# Altium project WSBD_Board.PrjPcb
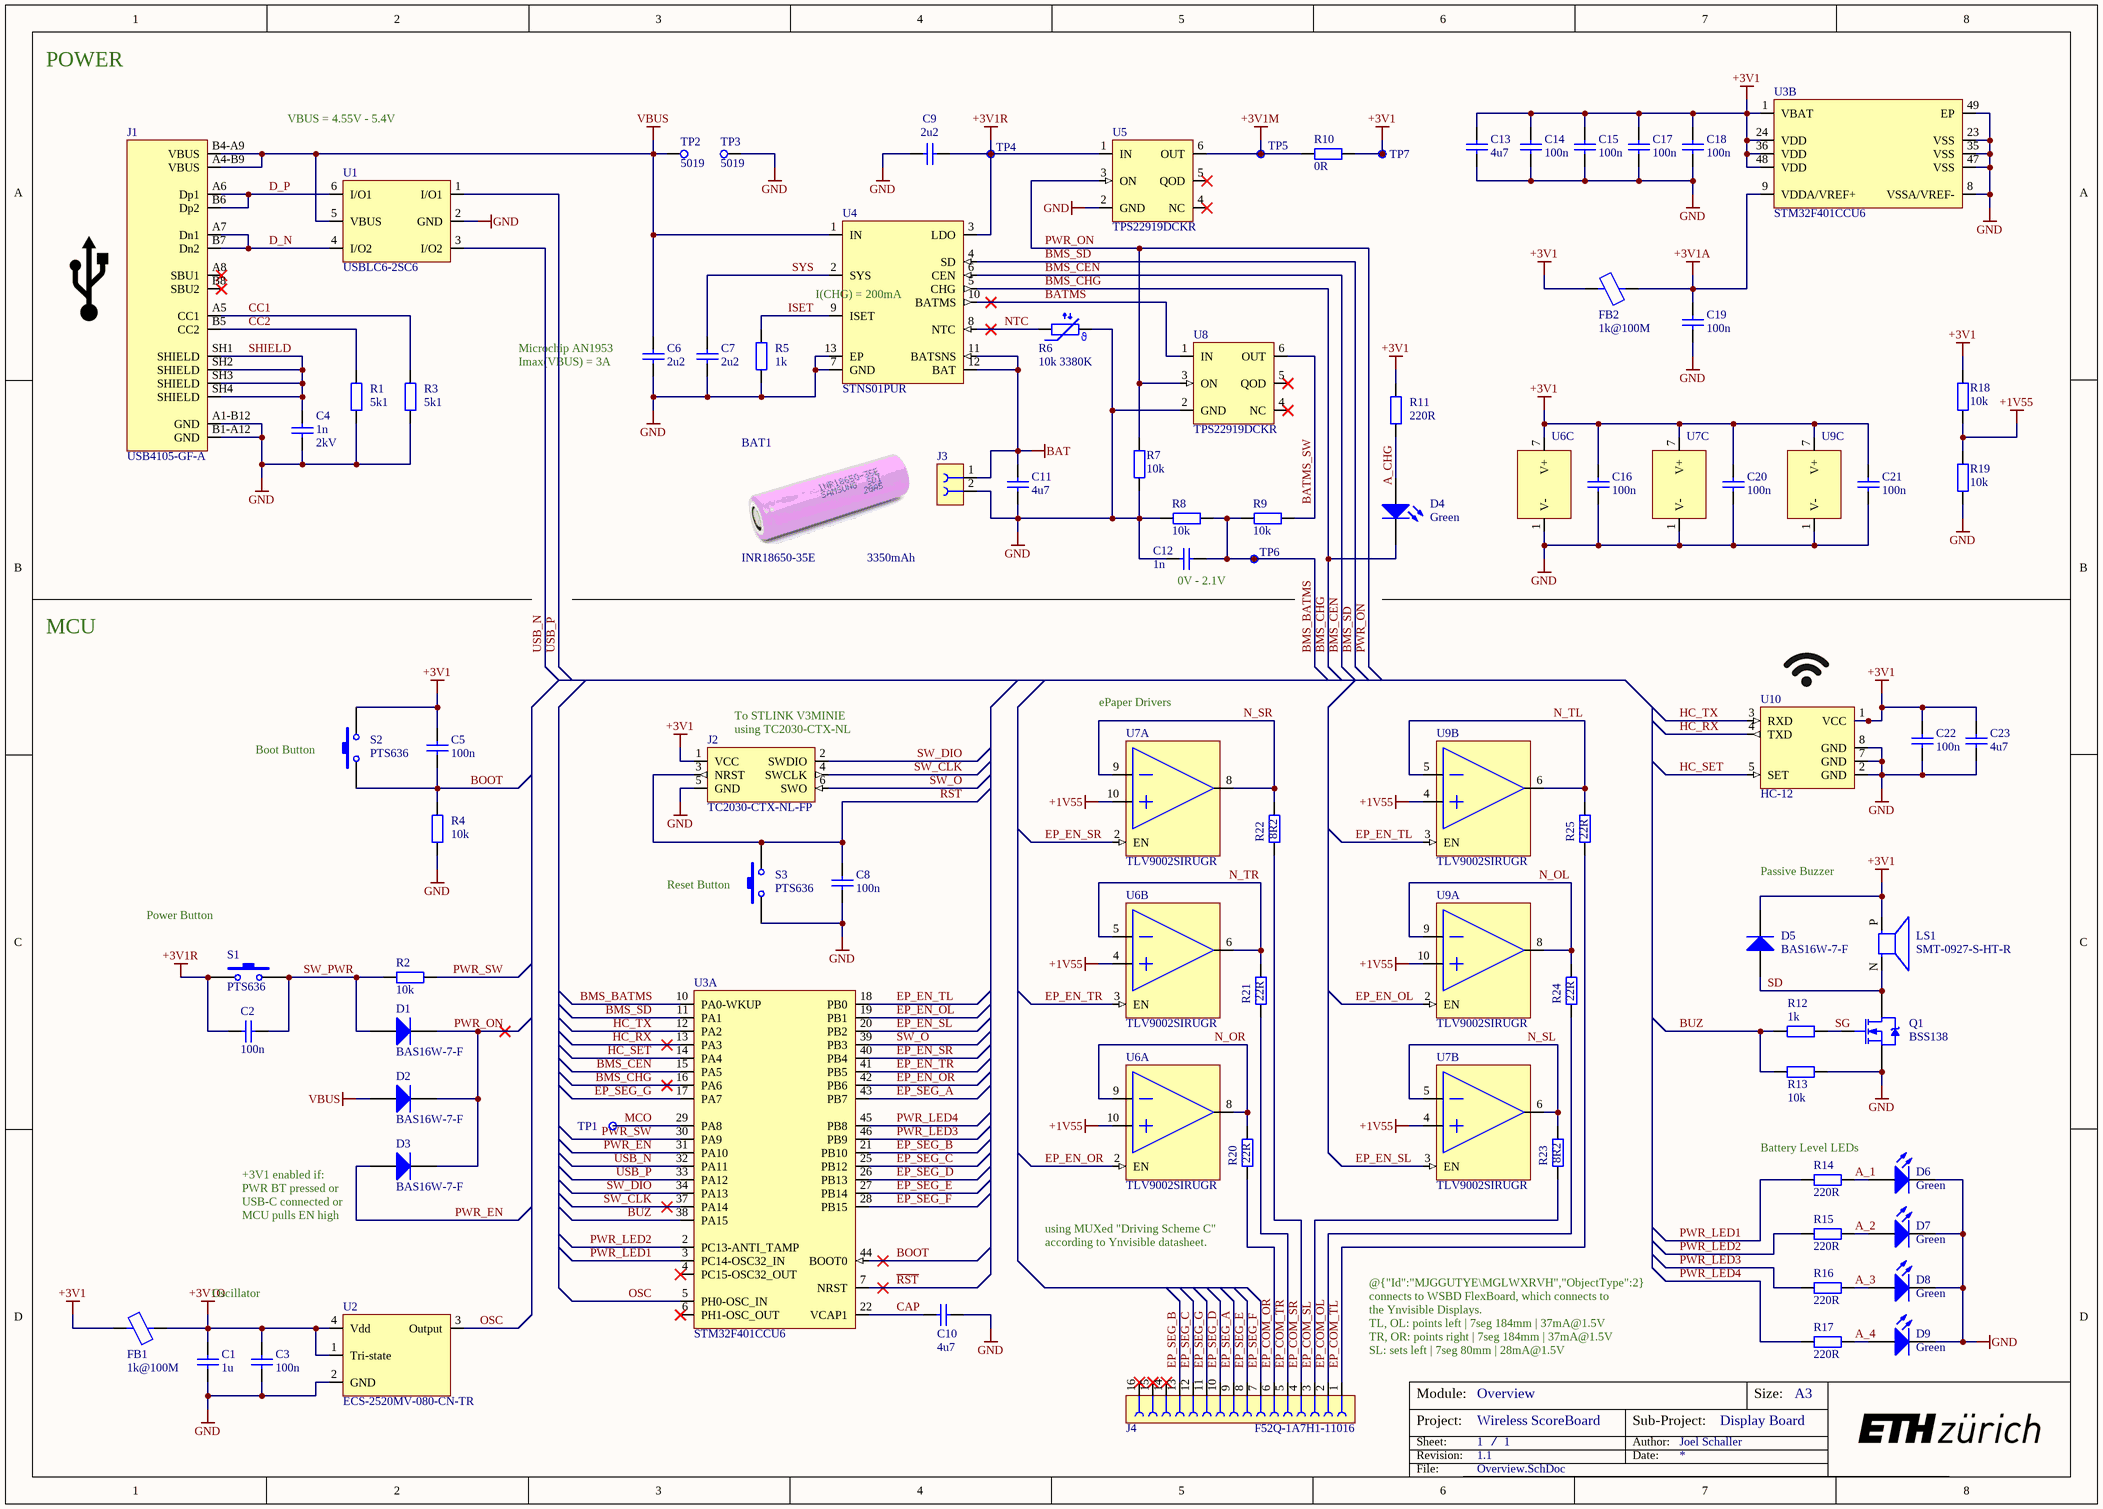
[diagram p0: Overview.SchDoc]
SubProject: Display Board; Revision: 1.1; Project: Wireless ScoreBoard; Author: Joel Schaller
1 sheet, 86 parts. Net scope: global (net labels, ports and power ports of the same name join across sheets).
Board file: WSBD_Board.PcbDoc

## Sheet Overview.SchDoc
size A3; SheetNumber: 1; SheetTotal: 1; Module: Overview

### Parts
BAT1  INR18650-35E  value 3350mAh  (mechanical)
C1  value 1u  [SMD_CAPC2012X12N]  (hidden comment: C0805)
C2  value 100n  [SMD_CAPC1005X06N]  (hidden comment: C0402)
C3  value 100n  [SMD_CAPC1005X06N]  (hidden comment: C0402)
C4  value 1n  Note: 2kV  [SMD_CAPC3216X16N]  (hidden comment: C1206)
C5  value 100n  [SMD_CAPC1005X06N]  (hidden comment: C0402)
C6  value 2u2  [SMD_CAPC2012X12N]  (hidden comment: C0805)
C7  value 2u2  [SMD_CAPC2012X12N]  (hidden comment: C0805)
C8  value 100n  [SMD_CAPC1005X06N]  (hidden comment: C0402)
C9  value 2u2  [SMD_CAPC2012X12N]  (hidden comment: C0805)
C10  value 4u7  [SMD_CAPC2012X12N]  (hidden comment: C0805)
C11  value 4u7  [SMD_CAPC2012X12N]  (hidden comment: C0805)
C12  value 1n  [SMD_CAPC1005X06N]  (hidden comment: C0402)
C13  value 4u7  [SMD_CAPC2012X12N]  (hidden comment: C0805)
C14  value 100n  [SMD_CAPC1005X06N]  (hidden comment: C0402)
C15  value 100n  [SMD_CAPC1005X06N]  (hidden comment: C0402)
C16  value 100n  [SMD_CAPC1005X06N]  (hidden comment: C0402)
C17  value 100n  [SMD_CAPC1005X06N]  (hidden comment: C0402)
C18  value 100n  [SMD_CAPC1005X06N]  (hidden comment: C0402)
C19  value 100n  [SMD_CAPC1005X06N]  (hidden comment: C0402)
C20  value 100n  [SMD_CAPC1005X06N]  (hidden comment: C0402)
C21  value 100n  [SMD_CAPC1005X06N]  (hidden comment: C0402)
C22  value 100n  [SMD_CAPC1005X06N]  (hidden comment: C0402)
C23  value 4u7  [SMD_CAPC2012X12N]  (hidden comment: C0805)
D1  BAS16W-7-F  [SOT323 SC70]
D2  BAS16W-7-F  [SOT323 SC70]
D3  BAS16W-7-F  [SOT323 SC70]
D4  value Green  [SMD_LED_0402]  (hidden comment: APHHS1005LZGCK-V)
D5  BAS16W-7-F  [SOT323 SC70]
D6  value Green  [SMD_LED_0402]  (hidden comment: APHHS1005LZGCK-V)
D7  value Green  [SMD_LED_0402]  (hidden comment: APHHS1005LZGCK-V)
D8  value Green  [SMD_LED_0402]  (hidden comment: APHHS1005LZGCK-V)
D9  value Green  [SMD_LED_0402]  (hidden comment: APHHS1005LZGCK-V)
FB1  value 1k@100M  [SMD_RESC1005X04N]  (hidden comment: BLM15BD102SN1D)
FB2  value 1k@100M  [SMD_RESC1005X04N]  (hidden comment: BLM15BD102SN1D)
J1  USB4105-GF-A  [USB4105-GF-A]
J2  TC2030-CTX-NL-FP  [SMD_TAG-CONNECT_TC2030-CTX-NL]  (no BOM)
J3  CONN SMD-PAD 2-Poles 1.6mm SMD  [CONN SMD-PAD 2-Poles 1.6mm SMD]  (value not drawn)  (no BOM)
J4  F52Q-1A7H1-11016  [F52Q-1A7H1-11016]
LS1  SMT-0927-S-HT-R  [SMT-0927-S-HT-R]
Q1  BSS138  [SOT323 SC70]
R1  value 5k1  [SMD_RESC1005X04N]  (hidden comment: R0402)
R2  value 10k  [SMD_RESC1005X04N]  (hidden comment: R0402)
R3  value 5k1  [SMD_RESC1005X04N]  (hidden comment: R0402)
R4  value 10k  [SMD_RESC1005X04N]  (hidden comment: R0402)
R5  value 1k  [SMD_RESC1005X04N]  (hidden comment: R0402)
R6  value 10k 3380K  [SMD_RESC1005X04N]  (hidden comment: NCU15XH103F6SRC)
R7  value 10k  [SMD_RESC1005X04N]  (hidden comment: R0402)
R8  value 10k  [SMD_RESC1005X04N]  (hidden comment: R0402)
R9  value 10k  [SMD_RESC1005X04N]  (hidden comment: R0402)
R10  value 0R  [SMD_RESC1005X04N]  (hidden comment: R0402)
R11  value 220R  [SMD_RESC1005X04N]  (hidden comment: R0402)
R12  value 1k  [SMD_RESC1005X04N]  (hidden comment: R0402)
R13  value 10k  [SMD_RESC1005X04N]  (hidden comment: R0402)
R14  value 220R  [SMD_RESC1005X04N]  (hidden comment: R0402)
R15  value 220R  [SMD_RESC1005X04N]  (hidden comment: R0402)
R16  value 220R  [SMD_RESC1005X04N]  (hidden comment: R0402)
R17  value 220R  [SMD_RESC1005X04N]  (hidden comment: R0402)
R18  value 10k  [SMD_RESC1005X04N]  (hidden comment: R0402)
R19  value 10k  [SMD_RESC1005X04N]  (hidden comment: R0402)
R20  value 22R  [SMD_RESC1005X04N]  (hidden comment: R0402)
R21  value 22R  [SMD_RESC1005X04N]  (hidden comment: R0402)
R22  value 8R2  [SMD_RESC1005X04N]  (hidden comment: R0402)
R23  value 8R2  [SMD_RESC1005X04N]  (hidden comment: R0402)
R24  value 22R  [SMD_RESC1005X04N]  (hidden comment: R0402)
R25  value 22R  [SMD_RESC1005X04N]  (hidden comment: R0402)
S1  PTS636  [PTS636 SK43 SMTR LFS]
S2  PTS636  [PTS636 SK43 SMTR LFS]
S3  PTS636  [PTS636 SK43 SMTR LFS]
TP1  Test Point  [SMD_PAD_1mm]  (value not drawn)  (no BOM)
TP2  5019  [KEYSTONE_5019]
TP3  5019  [KEYSTONE_5019]
TP4  Test Point  [SMD_PAD_1mm]  (value not drawn)  (no BOM)
TP5  Test Point  [SMD_PAD_1mm]  (value not drawn)  (no BOM)
TP6  Test Point  [SMD_PAD_1mm]  (value not drawn)  (no BOM)
TP7  Test Point  [SMD_PAD_1mm]  (value not drawn)  (no BOM)
U1  USBLC6-2SC6  [SOT95P280X145-6N]
U2  ECS-2520MV-080-CN-TR  [SMD_XTAL2520]
U3  STM32F401CCU6  [QFN50P700X700X60_HS-49N]  (parts A,B of 2)
U4  STNS01PUR  [SON45P300X80_HS-13N]
U5  TPS22919DCKR  [SOT65P210X110-6N]
U6  TLV9002SIRUGR  [TLA2024IRUGR]  (parts A,B,C of 3)
U7  TLV9002SIRUGR  [TLA2024IRUGR]  (parts A,B,C of 3)
U8  TPS22919DCKR  [SOT65P210X110-6N]
U9  TLV9002SIRUGR  [TLA2024IRUGR]  (parts A,B,C of 3)
U10  HC-12  [HC-12]

### Nets
+1V55: R18.1 R19.2 U6.4(Positiv_Input_B) U6.10(Positiv_Input_A) U7.4(Positiv_Input_B) U7.10(Positiv_Input_A) U9.4(Positiv_Input_B) U9.10(Positiv_Input_A)
+3V1: C5.2 C13.2 C14.2 C15.2 C16.2 C17.2 C18.2 C20.2 C21.2 C22.2 C23.2 D5.3(K) FB1.1 FB2.1 J2.1(VCC) LS1.P(POS) R10.1 R11.2 R18.2 S2.2 TP7.1 U3.1(VBAT) U3.24(VDD) U3.36(VDD) U3.48(VDD) U6.7(V+) U7.7(V+) U9.7(V+) U10.1(VCC)
+3V1A: C19.2 FB2.2 U3.9(VDDA/VREF+)
+3V1M: R10.2 TP5.1 U5.6(OUT)
+3V1O: C1.2 C3.2 FB1.2 U2.1(Tri-state) U2.4(Vdd)
+3V1R: C2.1 C9.1 S1.1 TP4.1 U4.3(LDO) U5.1(IN)
BAT: C11.2 J3.1 U4.11(BATSNS) U4.12(BAT)
GND: C1.1 C3.1 C4.1 C6.1 C7.1 C8.1 C9.2 C10.1 C11.1 C12.2 C13.1 C14.1 C15.1 C16.1 C17.1 C18.1 C19.1 C20.1 C21.1 C22.1 C23.1 D6.1(K) D7.1(K) D8.1(K) D9.1(K) J1.A1-B12(GND) J1.B1-A12(GND) J2.5(GND) J3.2 Q1.2(S) R1.1 R3.1 R4.2 R5.2 R6.2 R7.1 R8.1 R13.2 R19.1 S3.1 TP3.1 U1.2(GND) U2.2(GND) U3.8(VSSA/VREF-) U3.23(VSS) U3.35(VSS) U3.47(VSS) U3.49(EP) U4.7(GND) U4.13(EP) U5.2(GND) U6.1(V-) U7.1(V-) U8.2(GND) U9.1(V-) U10.2(GND) U10.7(GND) U10.8(GND)
VBUS: C6.2 D2.1(A) J1.A4-B9(VBUS) J1.B4-A9(VBUS) TP2.1 U1.5(VBUS) U4.1(IN)
A_1: D6.2(A) R14.1
A_2: D7.2(A) R15.1
A_3: D8.2(A) R16.1
A_4: D9.2(A) R17.1
A_CHG: D4.2(A) R11.1
~{BMS_CHG}: D4.1(K) U3.16(PA6) U4.5(CHG)
BATMS: U4.10(BATMS) U8.1(IN)
BATMS_SW: R9.2 U8.6(OUT)
BMS_BATMS: C12.1 R8.2 R9.1 TP6.1 U3.10(PA0-WKUP)
BMS_CEN: U3.15(PA5) U4.6(CEN)
BMS_SD: U3.11(PA1) U4.4(SD)
BOOT: C5.1 R4.1 S2.1 U3.44(BOOT0)
BUZ: R12.1 R13.1 U3.38(PA15)
CAP: C10.2 U3.22(VCAP1)
CC1: J1.A5(CC1) R3.2
CC2: J1.B5(CC2) R1.2
D_N: J1.A7(Dn1) J1.B7(Dn2) U1.4(I/O2)
D_P: J1.A6(Dp1) J1.B6(Dp2) U1.6(I/O1)
EP_COM_OL: J4.2 R24.1
EP_COM_OR: J4.6 R20.1
EP_COM_SL: J4.3 R23.1
EP_COM_SR: J4.4 R22.1
EP_COM_TL: J4.1 R25.1
EP_COM_TR: J4.5 R21.1
EP_EN_OL: U3.19(PB1) U9.2(EN)
EP_EN_OR: U3.42(PB6) U6.2(EN)
EP_EN_SL: U3.20(PB2) U7.3(EN)
EP_EN_SR: U3.40(PB4) U7.2(EN)
EP_EN_TL: U3.18(PB0) U9.3(EN)
EP_EN_TR: U3.41(PB5) U6.3(EN)
EP_SEG_A: J4.9 U3.43(PB7)
EP_SEG_B: J4.13 U3.21(PB10)
EP_SEG_C: J4.12 U3.25(PB12)
EP_SEG_D: J4.10 U3.26(PB13)
EP_SEG_E: J4.8 U3.27(PB14)
EP_SEG_F: J4.7 U3.28(PB15)
EP_SEG_G: J4.11 U3.17(PA7)
HC_RX: U3.13(PA3) U10.4(TXD)
HC_SET: U3.14(PA4) U10.5(SET)
HC_TX: U3.12(PA2) U10.3(RXD)
ISET: R5.1 U4.9(ISET)
MCO: TP1.1 U3.29(PA8)
N_OL: R24.2 U9.8(Output_A) U9.9(Negativ_Input_A)
N_OR: R20.2 U6.8(Output_A) U6.9(Negativ_Input_A)
N_SL: R23.2 U7.5(Negativ_Input_B) U7.6(Output_B)
N_SR: R22.2 U7.8(Output_A) U7.9(Negativ_Input_A)
N_TL: R25.2 U9.5(Negativ_Input_B) U9.6(Output_B)
N_TR: R21.2 U6.5(Negativ_Input_B) U6.6(Output_B)
NTC: R6.1 U4.8(NTC)
OSC: U2.3(Output) U3.5(PH0-OSC_IN)
PWR_EN: D3.1(A) U3.31(PA10)
PWR_LED1: R14.2 U3.3(PC14-OSC32_IN)
PWR_LED2: R15.2 U3.2(PC13-ANTI_TAMP)
PWR_LED3: R16.2 U3.46(PB9)
PWR_LED4: R17.2 U3.45(PB8)
PWR_ON: D1.3(K) D2.3(K) D3.3(K) R7.2 U5.3(ON) U8.3(ON)
PWR_SW: R2.2 U3.30(PA9)
~{RST}: C8.2 J2.3(NRST) S3.2 U3.7(NRST)
SD: D5.1(A) LS1.N(NEG) Q1.3(D)
SG: Q1.1(G) R12.2
SHIELD: C4.2 J1.SH1(SHIELD) J1.SH2(SHIELD) J1.SH3(SHIELD) J1.SH4(SHIELD)
SW_CLK: J2.4(SWCLK) U3.37(PA14)
SW_DIO: J2.2(SWDIO) U3.34(PA13)
SW_O: J2.6(SWO) U3.39(PB3)
SW_PWR: C2.2 D1.1(A) R2.1 S1.2
SYS: C7.2 U4.2(SYS)
USB_N: U1.3(I/O2) U3.32(PA11)
USB_P: U1.1(I/O1) U3.33(PA12)

Not connected (* = marked no-connect by the designer): J1 A8(SBU1)* B8(SBU2)*; J4 14* 15* 16*; U3 4(PC15-OSC32_OUT)* 6(PH1-OSC_OUT)*; U5 4(NC)* 5(QOD)*; U8 4(NC)* 5(QOD)*

### Notes on the sheet
- POWER
- VBUS = 4.55V - 5.4V
- I(CHG) = 200mA
- (near R3) Microchip AN1953
- (near R3) Imax(VBUS) = 3A
- (near TP6) 0V - 2.1V
- MCU
- ePaper Drivers
- (near S2) Boot Button
- (near J2) To STLINK V3MINIE
  using TC2030-CTX-NL
- Power Button
- (near S3) Reset Button
- Passive Buzzer
- Battery Level LEDs
- (near D3) +3V1 enabled if:
  PWR BT pressed or
  USB-C connected or
  MCU pulls EN high
- using MUXed "Driving Scheme C" according to Ynvisible datasheet.
- Oscillator
- (near J4) @{"Id":"MJGGUTYE\MGLWXRVH","ObjectType":2} connects to WSBD FlexBoard, which connects to the Ynvisible Displays.
  TL, OL: points left | 7seg 184mm | 37mA@1.5V
  TR, OR: points right | 7seg 184mm | 37mA@1.5V
  SL: sets left | 7seg 80mm | 28mA@1.5V
  SR: sets right | 7seg 80mm | 28mA@1.5V
- Module:
- Size:
- A3
- Revision:
- Sheet:
- Project:
- /
- Sub-Project:
- Date:
- Author:
- File:
- (in symbol CMP-02981-1) ϑ

### Library data of the parts
BAT1 = CMP-03070-2: EMECH SINGLE BATTERY LIPO; Manufacturer: Samsung; Manufacturer Part Number: INR18650-35E; Supplier: Conrad; Supplier Part Number: 1499572 - 62
C1 = CMP-02451-1: CERCAP 1u 25V 10% X7R 0805; Manufacturer: YAGEO; Manufacturer Part Number: CC0805KKX7R8BB105; Supplier: Digi-Key; Supplier Part Number: 311-1456-1-ND; Supplier2: Mouser; Supplier2 Part Number: 603-CC805KKX7R8BB105
C2 C3 C5 C8 C14-C22 = CMP-02708-2: CERCAP 100n 50V 10% X7R 0402; Manufacturer: YAGEO; Manufacturer Part Number: CC0402KRX7R9BB104; Note: 50V; Supplier: Digi-Key; Supplier Part Number: 311-3566-1-ND; Supplier2: Mouser; Supplier2 Part Number: 603-CC402KRX7R9BB104
C4 = CMP-02123-1: CERCAP 1n 2kV 10% X7R 1206; Manufacturer: Würth Elektronik; Manufacturer Part Number: 885342208024; Supplier: Digi-Key; Supplier Part Number: 732-885342208024CT-ND; Supplier2: Mouser; Supplier2 Part Number: 710-885342208024
C6 C7 C9 = CMP-02451-1: CERCAP 2u2 25V 10% X7R 0805; Manufacturer: YAGEO; Manufacturer Part Number: CC0805KKX7R8BB225; Supplier: Digi-Key; Supplier Part Number: 311-1884-1-ND; Supplier2: Mouser; Supplier2 Part Number: 603-CC805KKX7R8BB225
C10 C11 C13 C23 = CMP-02451-1: CERCAP 4u7 25V 10% X7R 0805; Manufacturer: YAGEO; Manufacturer Part Number: CC0805KKX7R8BB475; Supplier: Digi-Key; Supplier Part Number: 311-1885-1-ND; Supplier2: Mouser; Supplier2 Part Number: 603-CC805KKX7R8BB475
C12 = CMP-02708-2: CERCAP 1n 50V 10% X7R 0402; Manufacturer: YAGEO; Manufacturer Part Number: CC0402KRX7R9BB102; Note: 50V; Supplier: Digi-Key; Supplier Part Number: 311-1036-1-ND; Supplier2: Mouser; Supplier2 Part Number: 603-CC402KRX7R9BB102
D1-D3 D5 = CMP-03049-1: DIODE 200mW 75V 300mA SOT-323; Manufacturer: Diodes Incorporated; Supplier2: Mouser; Supplier Part Number: BAS16W-FDICT-ND; Supplier2 Part Number: 621-BAS16W-F; Supplier: Digi-Key; Manufacturer Part Number: BAS16W-7-F
D4 D6-D9 = CMP-01377-1: LED GREEN 2mA 2.65V 0402; Manufacturer: Kingbright; Manufacturer Part Number: APHHS1005LZGCK-V; Supplier: DigiKey; Supplier Part Number: 754-2126-1-ND; Supplier2: Mouser; Supplier2 Part Number: 604-APHHS1005LZGCK-V
FB1 FB2 = CMP-03004-1: FERRITE 200mA-1k 0402; Manufacturer: Murata Electronics; Note: 1.5kR@100MHz; Supplier Part Number: 490-1010-1-ND; Supplier: Digi-Key; Supplier2 Part Number: 81-BLM15BD102SN1D; Supplier2: Mouser; Manufacturer Part Number: BLM15BD102SN1D
J1 = CMP-02911-2: CONN Female USB-C 16x Horizontal SMD; Manufacturer: GCT; Manufacturer Part Number: USB4105-GF-A; Supplier: Digi-Key; Supplier Part Number: 2073-USB4105-GF-ACT-ND; Supplier2: Mouser; Supplier2 Part Number: 640-USB4105-GF-A
J2 = CMPL-001-0427-A.2: TP TAG-CONNECT 7.6x9mm
J3 = CMP-02986-2
J4 = CMP-03079-1: CONN FPC TOP 16POS 1mm; Manufacturer: Amphenol ICC (FCI); Manufacturer Part Number: F52Q-1A7H1-11016; Supplier: Digi-Key; Supplier Part Number: 609-F52Q-1A7H1-11016CT-ND; Supplier2: Mouser; Supplier2 Part Number: 649-F52Q-1A7H1-11016
LS1 = CMPL-001-0503-1: PASSIVE PIEZO_BUZZER 8.5x8.5x4.3mm; Manufacturer: PUI Audio, Inc.; Supplier2 Part Number: 665-SMT0927SHTR; Supplier Part Number: 668-SMT-0927-S-HT-RCT-ND; Manufacturer Part Number: SMT-0927-S-HT-R; Supplier: Digi-Key; Supplier2: Mouser
Q1 = CMP-01592-2: MOSFET N 0.2A 50V SOT323; Manufacturer2 Part Number: BSS138W-TP; Manufacturer: Diodes Incorporated; Manufacturer Part Number: BSS138W-7-F; Manufacturer2: Micro Commercial Co; Supplier2 Part Number: BSS138W-TPMSCT-ND; Supplier2: Digi-Key; Supplier Part Number: BSS138W-FDICT-ND; Supplier: Digi-Key
R1 R3 = CMP-02880-1: RES 5k1 62.5mW 1% 0402; Manufacturer: YAGEO; Manufacturer Part Number: RC0402FR-075K1L; Supplier: Digi-Key; Supplier Part Number: 311-5.10KLRCT-ND; Supplier2: Mouser; Supplier2 Part Number: 603-RC0402FR-075K1L
R2 R4 R7-R9 R13 R18 R19 = CMP-02880-1: RES 10k 62.5mW 1% 0402; Manufacturer: YAGEO; Manufacturer Part Number: RC0402FR-0710KL; Supplier: Digi-Key; Supplier Part Number: 311-10.0KLRCT-ND; Supplier2: Mouser; Supplier2 Part Number: 603-RC0402FR-0710KL
R5 R12 = CMP-02880-1: RES 1k 62.5mW 1% 0402; Manufacturer: YAGEO; Manufacturer Part Number: RC0402FR-071KL; Supplier: Digi-Key; Supplier Part Number: 311-1.00KLRCT-ND; Supplier2: Mouser; Supplier2 Part Number: 603-RC0402FR-071KL
R6 = CMP-02981-1: RES NTC 10k 3380K; Manufacturer: Murata Electronics; Manufacturer Part Number: NCU15XH103F6SRC; Supplier: Digi-Key; Supplier Part Number: 490-NCU15XH103F6SRCCT-ND; Supplier2: Mouser; Supplier2 Part Number: 81-NCU15XH103F6SRC
R10 = CMP-02880-1: RES 0R 0402; Manufacturer: YAGEO; Manufacturer Part Number: RC0402FR-070RL; Supplier: Digi-Key; Supplier Part Number: 311-0.0LRCT-ND; Supplier2: Mouser; Supplier2 Part Number: 603-RC0402FR-070RL
R11 R14-R17 = CMP-02880-1: RES 220R 62.5mW 1% 0402; Manufacturer: YAGEO; Manufacturer Part Number: RC0402FR-07220RL; Supplier: Digi-Key; Supplier Part Number: 311-220LRCT-ND; Supplier2: Mouser; Supplier2 Part Number: 603-RC0402FR-07220RL
R20 R21 R24 R25 = CMP-02880-1: RES 22R 62.5mW 1% 0402; Manufacturer: YAGEO; Manufacturer Part Number: RC0402FR-0722RL; Supplier: Digi-Key; Supplier Part Number: 311-22.0LRCT-ND; Supplier2: Mouser; Supplier2 Part Number: 603-RC0402FR-0722RL
R22 R23 = CMP-02880-1: RES 8R2 62.5mW 1% 0402; Manufacturer: YAGEO; Manufacturer Part Number: RC0402FR-078R2L; Supplier: Digi-Key; Supplier Part Number: 13-RC0402FR-078R2LCT-ND; Supplier2: Mouser; Supplier2 Part Number: 603-RC0402FR-078R2L
S1-S3 = CMP-03040-1: BUTTON SPST 12V 50mA 6x3.5x4.3mm; Manufacturer: C&K; Manufacturer Part Number: PTS636 SK43 SMTR LFS; Supplier: Digi-Key; Supplier Part Number: CKN12311-1-ND; Supplier2: Mouser; Supplier2 Part Number: 611-PTS636SK43SMTRLF
TP1 TP4-TP7 = CMP-02902-2: TP TESTPOINT MULTIPLE_SIZE
TP2 TP3 = CMPL-001-0505-10: TP SMD 3.81x 2.03mm; Manufacturer: Keystone Electronics; Design Item ID: 5019; Source: 5019.SchLib; Manufacturer Part Number: 5019; Supplier: Digi-Key; Supplier Part Number: 36-5019CT-ND
U1 = CMP-02913-1: IC Dual ESD Protection SOT23-6; Manufacturer: STMicroelectronics; Manufacturer Part Number: USBLC6-2SC6; Note: ESD; Supplier: Digi-Key; Supplier Part Number: 497-5235-1-ND; Supplier2: Mouser; Supplier2 Part Number: 511-USBLC6-2SC6
U2 = CMP-02862-4: OSC 8MHz Enable/Disable 1.6V-3.6V 4-SMD 2.5x2mm; Manufacturer: ECS Inc.; Manufacturer Part Number: ECS-2520MV-080-CN-TR; Supplier: Digi-Key; Supplier Part Number: XC3029CT-ND
U3 = CMP-03026-4: MCU ARM-Cortex-M4 256kB_FLASH 64kB_RAM 1.7-3.6V UFQFPN48; Manufacturer: STMicroelectronics; Manufacturer Part Number: STM32F401CCU6; Supplier: Digi-Key; Supplier Part Number: 497-17426-ND; Supplier2: Mouser; Supplier2 Part Number: 511-STM32F401CCU6
U4 = CMPL-001-0518-A.2: Charger Single LiIon 5.4V 12-DFN; Manufacturer: STMicroelectronics; Manufacturer Part Number: STNS01PUR; Supplier: Digi-Key; Supplier Part Number: 497-13880-1-ND; Supplier2: Mouser; Supplier2 Part Number: 511-STNS01PUR
U5 U8 = CMPL-001-0510-A.1: POWER-DISTRIBUTION Single Switch 5.5V SOT363; Manufacturer: Texas Instruments; Manufacturer Part Number: TPS22919DCKR; Supplier: Digi-Key; Supplier Part Number: 296-TPS22919DCKRCT-ND; Supplier2: Mouser; Supplier2 Part Number: 595-TPS22919DCKR
U6 U7 U9 = CMP-03072-1: OPAMP DUAL 1MHz 1.8-5.5V X2QFN; Manufacturer: Texas Instruments; Manufacturer Part Number: TLV9002SIRUGR; Supplier: Digi-Key; Supplier Part Number: 296-TLV9002SIRUGRCT-ND; Supplier2: Mouser; Supplier2 Part Number: 595-TLV9002SIRUGR; PartId: 1
U10 = CMP-03065-1: RF Module UART; Manufacturer: HC Tech; Manufacturer Part Number: HC-12; Supplier: AliExpress; Supplier Part Number: HC-12